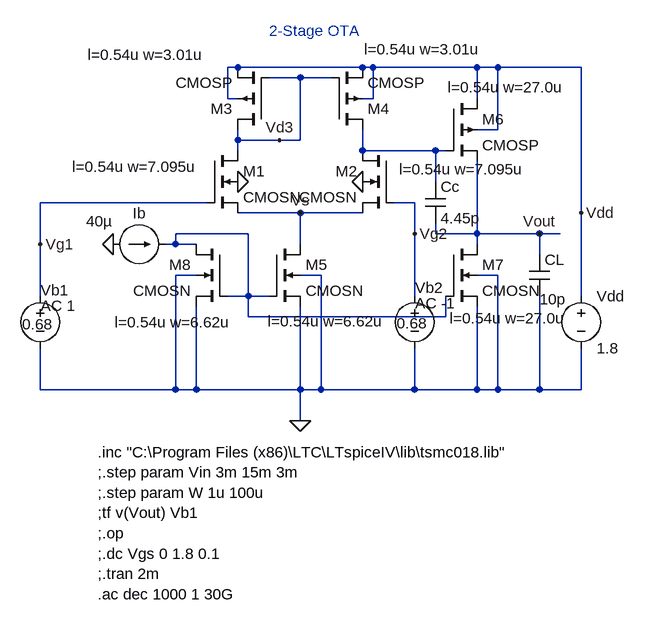
[diagram p0: schematic ota2.asc]
ota2.asc, the LTspice schematic file:
Version 4
SHEET 1 880 888
WIRE 48 64 32 64
WIRE 240 64 48 64
WIRE 256 64 240 64
WIRE 416 64 256 64
WIRE 448 64 416 64
WIRE 576 64 448 64
WIRE 144 80 96 80
WIRE 192 80 144 80
WIRE 32 112 32 64
WIRE 48 112 32 112
WIRE 256 112 256 64
WIRE 256 112 240 112
WIRE 416 112 416 64
WIRE 448 160 448 64
WIRE 448 160 416 160
WIRE 48 176 48 160
WIRE 112 176 48 176
WIRE 144 176 144 80
WIRE 144 176 112 176
WIRE 48 192 48 176
WIRE 240 192 240 160
WIRE 352 192 240 192
WIRE 368 192 352 192
WIRE 352 240 352 192
WIRE 0 272 -256 272
WIRE 320 272 288 272
WIRE 144 288 48 288
WIRE 240 288 144 288
WIRE 576 288 576 64
WIRE 64 320 -48 320
WIRE 320 320 320 272
WIRE 352 320 352 304
WIRE 416 320 416 208
WIRE 416 320 352 320
WIRE 512 320 416 320
WIRE 544 320 512 320
WIRE -256 336 -256 272
WIRE -48 336 -48 320
WIRE -48 336 -64 336
WIRE -16 336 -48 336
WIRE 144 336 144 288
WIRE 416 336 416 320
WIRE 512 352 512 320
WIRE -16 384 -48 384
WIRE 176 384 144 384
WIRE 448 384 416 384
WIRE -256 416 -256 336
WIRE 64 416 64 320
WIRE 64 416 32 416
WIRE 96 416 64 416
WIRE 320 416 320 320
WIRE 576 416 576 288
WIRE 64 448 64 416
WIRE 368 448 368 416
WIRE 368 448 64 448
WIRE -256 560 -256 496
WIRE -48 560 -48 384
WIRE -48 560 -256 560
WIRE -16 560 -16 432
WIRE -16 560 -48 560
WIRE 144 560 144 432
WIRE 144 560 -16 560
WIRE 176 560 176 384
WIRE 176 560 144 560
WIRE 320 560 320 496
WIRE 320 560 176 560
WIRE 416 560 416 432
WIRE 416 560 320 560
WIRE 448 560 448 384
WIRE 448 560 416 560
WIRE 512 560 512 416
WIRE 512 560 448 560
WIRE 576 560 576 496
WIRE 576 560 512 560
WIRE 144 608 144 560
FLAG 48 240 0
FLAG 240 240 0
FLAG 144 608 0
FLAG 112 176 Vd3
FLAG 320 320 Vg2
FLAG -256 336 Vg1
FLAG 144 288 Vs
FLAG -144 336 0
FLAG 576 288 Vdd
FLAG 512 320 Vout
SYMBOL cmosn 0 192 R0
WINDOW 123 -207 25 Left 2
SYMATTR Value2 l=0.54u w=7.095u
SYMATTR InstName M1
SYMBOL cmosn 288 192 M0
WINDOW 123 -201 29 Left 2
SYMATTR Value2 l=0.54u w=7.095u
SYMATTR InstName M2
SYMBOL cmosp 96 160 R180
WINDOW 123 100 115 Left 2
SYMATTR Value2 l=0.54u w=3.01u
SYMATTR InstName M3
SYMBOL cmosp 192 160 M180
WINDOW 123 50 124 Left 2
SYMATTR Value2 l=0.54u w=3.01u
SYMATTR InstName M4
SYMBOL cmosn 96 336 R0
WINDOW 123 -2 119 Left 2
SYMATTR Value2 l=0.54u w=6.62u
SYMATTR InstName M5
SYMBOL voltage 576 400 R0
WINDOW 123 0 0 Left 2
WINDOW 39 0 0 Left 2
SYMATTR InstName Vdd
SYMATTR Value 1.8
SYMBOL voltage -256 400 R0
WINDOW 3 -28 59 Left 2
WINDOW 0 1 7 Left 2
WINDOW 123 1 31 Left 2
WINDOW 39 0 0 Left 2
SYMATTR Value 0.68
SYMATTR InstName Vb1
SYMATTR Value2 AC 1
SYMBOL voltage 320 400 R0
WINDOW 3 -28 58 Left 2
WINDOW 0 1 3 Left 2
WINDOW 123 1 27 Left 2
WINDOW 39 0 0 Left 2
SYMATTR Value 0.68
SYMATTR InstName Vb2
SYMATTR Value2 AC -1
SYMBOL cmosn 32 336 M0
WINDOW 123 -6 120 Left 2
SYMATTR Value2 l=0.54u w=6.62u
SYMATTR InstName M8
SYMBOL current -144 336 R270
WINDOW 0 32 40 VTop 2
WINDOW 3 51 -21 VBottom 2
WINDOW 123 0 0 Left 2
WINDOW 39 0 0 Left 2
SYMATTR InstName Ib
SYMATTR Value 40µ
SYMBOL cap 496 352 R0
WINDOW 3 16 69 Left 2
SYMATTR Value 10p
SYMATTR InstName CL
SYMBOL cmosp 368 112 R0
WINDOW 123 3 -17 Left 2
SYMATTR Value2 l=0.54u w=27.0u
SYMATTR InstName M6
SYMBOL cap 336 240 R0
SYMATTR InstName Cc
SYMATTR Value 4.45p
SYMBOL cmosn 368 336 R0
WINDOW 123 6 114 Left 2
SYMATTR Value2 l=0.54u w=27.0u
SYMATTR InstName M7
TEXT 96 8 Left 2 ;2-Stage OTA
TEXT -168 656 Left 2 !.inc "C:\\Program Files (x86)\\LTC\\LTspiceIV\\lib\\tsmc018.lib"\n;.step param Vin 3m 15m 3m\n;.step param W 1u 100u\n;tf v(Vout) Vb1\n;.op\n;.dc Vgs 0 1.8 0.1\n;.tran 2m\n.ac dec 1000 1 30G

The netlist it stands for:
* ota2.asc
M1 Vd3 Vg1 Vs 0 CMOSN l=0.54u w=7.095u
M2 N001 Vg2 Vs 0 CMOSN l=0.54u w=7.095u
M3 Vd3 Vd3 Vdd Vdd CMOSP l=0.54u w=3.01u
M4 N001 Vd3 Vdd Vdd CMOSP l=0.54u w=3.01u
M5 Vs N002 0 0 CMOSN l=0.54u w=6.62u
Vdd Vdd 0 1.8
Vb1 Vg1 0 0.68 AC 1
Vb2 Vg2 0 0.68 AC -1
M8 N002 N002 0 0 CMOSN l=0.54u w=6.62u
Ib 0 N002 40µ
CL Vout 0 10p
M6 Vdd N001 Vout Vdd CMOSP l=0.54u w=27.0u
Cc N001 Vout 4.45p
M7 Vout N002 0 0 CMOSN l=0.54u w=27.0u
.model NMOS NMOS
.model PMOS PMOS
.lib standard.mos
* 2-Stage OTA
.inc "C:\Program Files (x86)\LTC\LTspiceIV\lib\tsmc018.lib"
;.step param Vin 3m 15m 3m
;.step param W 1u 100u
;tf v(Vout) Vb1
;.op
;.dc Vgs 0 1.8 0.1
;.tran 2m
.ac dec 1000 1 30G
.backanno
.end